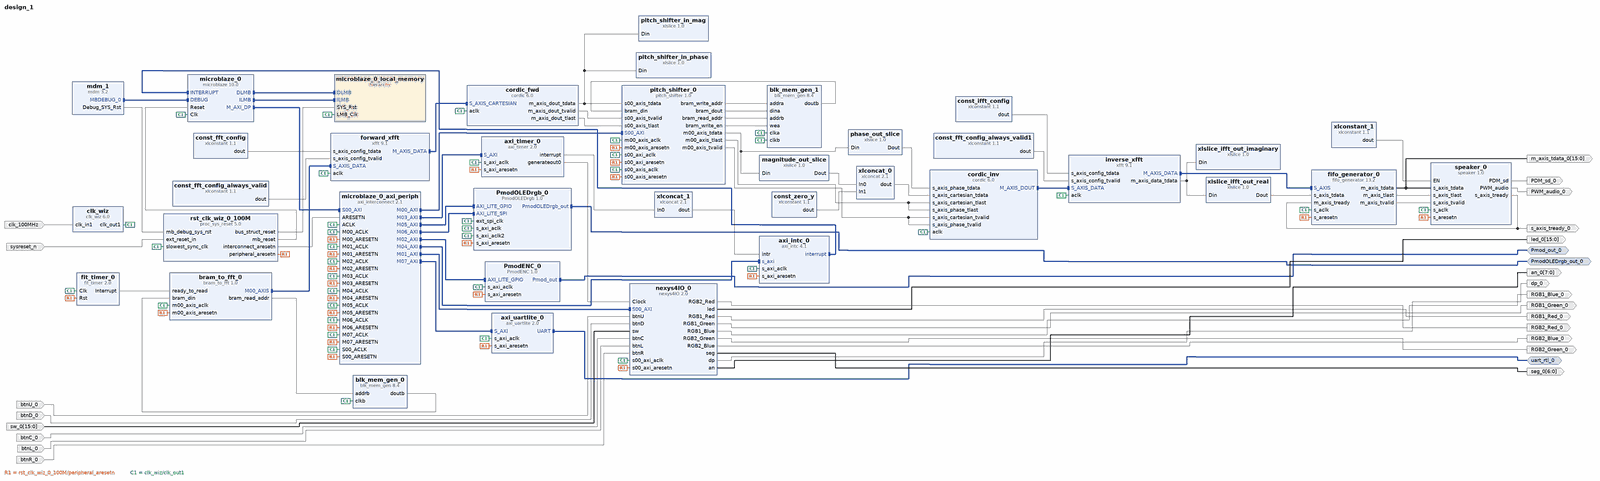
[diagram p0: block diagram of the top level, whole]
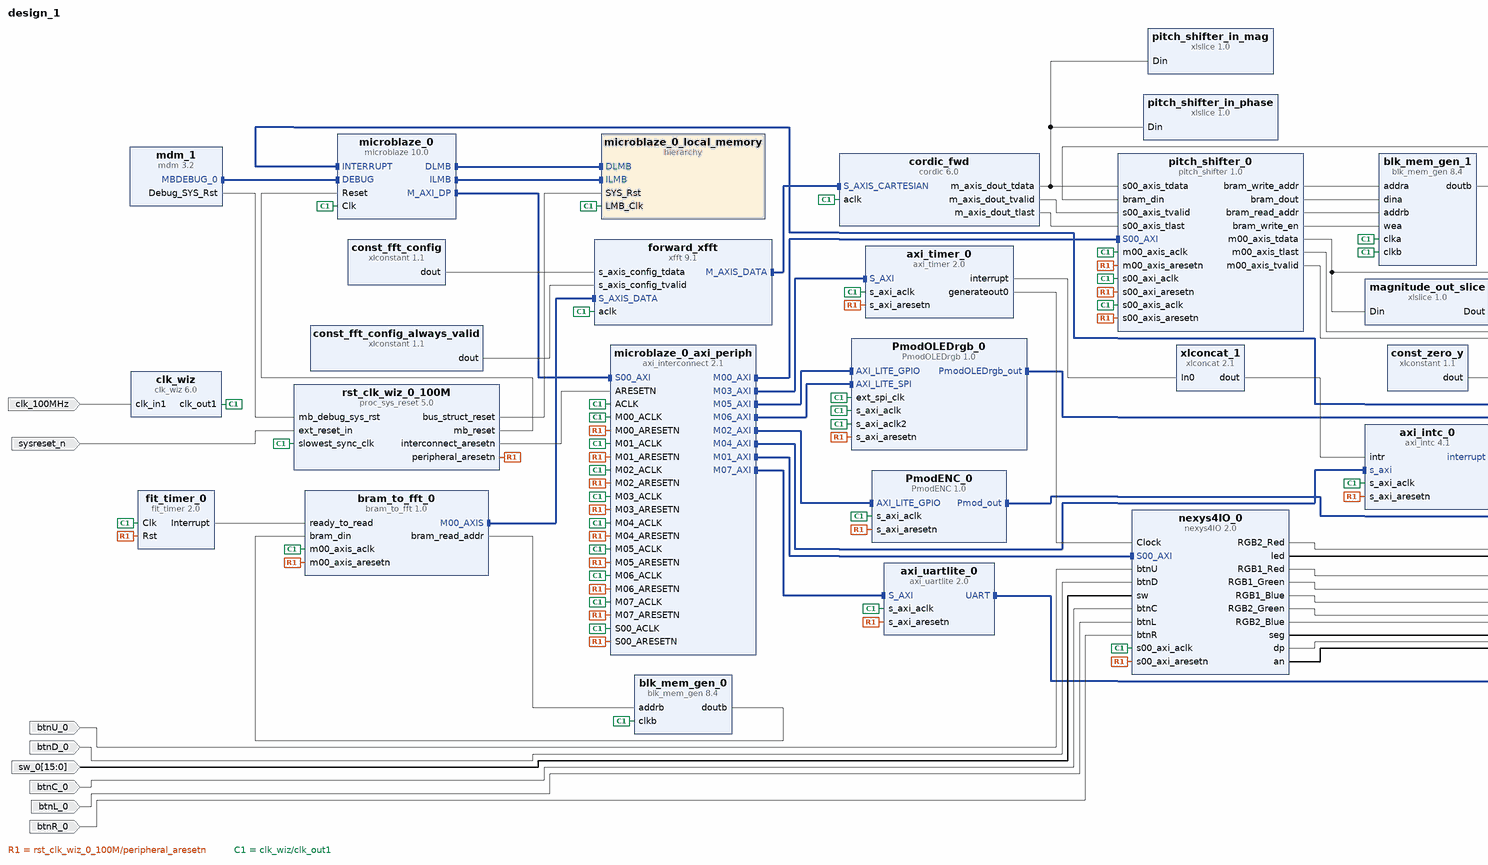
[diagram p1: block diagram of the top level, left part]
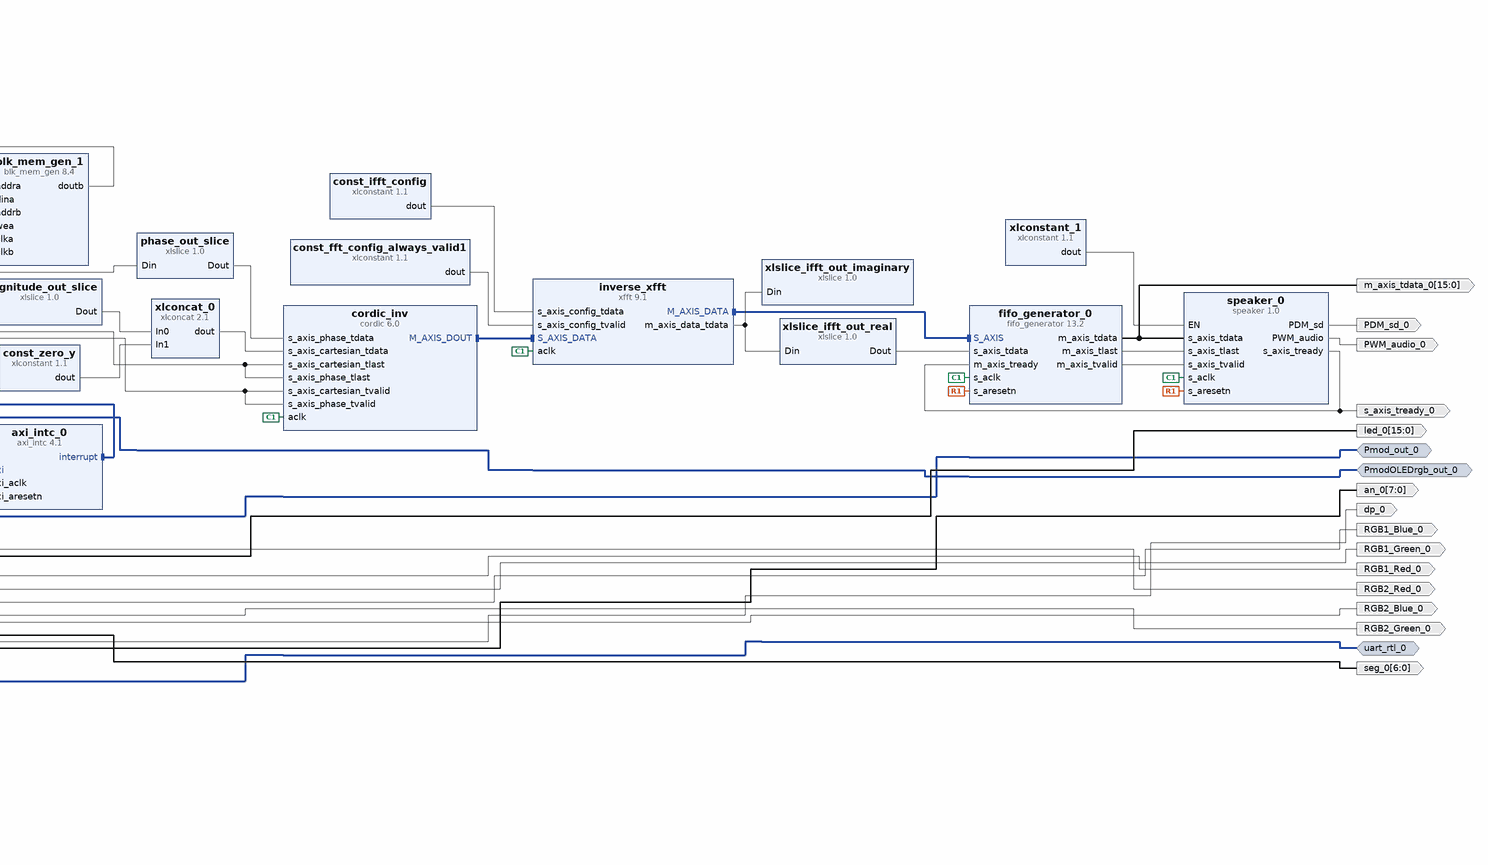
[diagram p2: block diagram of the top level, right part]
# Vivado block design design_1, xc7a100tcsg324-1, Vivado 2018.2
create_bd_design design_1

create_bd_intf_port -mode Master -vlnv digilentinc.com:interface:pmod_rtl:1.0 Pmod_out_0
create_bd_intf_port -mode Master -vlnv digilentinc.com:interface:pmod_rtl:1.0 PmodOLEDrgb_out_0
create_bd_intf_port -mode Master -vlnv xilinx.com:interface:uart_rtl:1.0 uart_rtl_0
create_bd_port -dir I -type clk clk_100MHz
set_property -dict {CONFIG.FREQ_HZ 100000000} [get_bd_ports clk_100MHz]
create_bd_port -dir I btnU_0
create_bd_port -dir I btnD_0
create_bd_port -dir I -from 15 -to 0 sw_0
create_bd_port -dir I btnC_0
create_bd_port -dir I btnL_0
create_bd_port -dir I btnR_0
create_bd_port -dir O RGB2_Red_0
create_bd_port -dir O -from 15 -to 0 led_0
create_bd_port -dir O RGB1_Red_0
create_bd_port -dir O RGB1_Green_0
create_bd_port -dir O RGB1_Blue_0
create_bd_port -dir O RGB2_Green_0
create_bd_port -dir O RGB2_Blue_0
create_bd_port -dir O -from 6 -to 0 seg_0
create_bd_port -dir O dp_0
create_bd_port -dir O -from 7 -to 0 an_0
create_bd_port -dir O PWM_audio_0
create_bd_port -dir O PDM_sd_0
create_bd_port -dir I -type rst sysreset_n
set_property -dict {CONFIG.POLARITY ACTIVE_LOW} [get_bd_ports sysreset_n]
create_bd_port -dir O -from 15 -to 0 m_axis_tdata_0
create_bd_port -dir O s_axis_tready_0

create_bd_cell -type ip -vlnv xilinx.com:ip:xfft:9.1 forward_xfft
set_property -dict [list \
  CONFIG.transform_length 4096 \
  CONFIG.target_clock_frequency 100 \
  CONFIG.implementation_options automatically_select \
  CONFIG.target_data_throughput 1 \
  CONFIG.phase_factor_width 9 \
  CONFIG.scaling_options scaled \
  CONFIG.xk_index true \
  CONFIG.output_ordering natural_order \
  CONFIG.number_of_stages_using_block_ram_for_data_and_phase_factors 0 \
] [get_bd_cells forward_xfft]
create_bd_cell -type ip -vlnv xilinx.com:ip:blk_mem_gen:8.4 blk_mem_gen_0
set_property -dict [list \
  CONFIG.Memory_Type Simple_Dual_Port_RAM \
  CONFIG.Enable_32bit_Address false \
  CONFIG.Use_Byte_Write_Enable false \
  CONFIG.Assume_Synchronous_Clk false \
  CONFIG.Write_Width_A 16 \
  CONFIG.Write_Depth_A 4096 \
  CONFIG.Operating_Mode_A READ_FIRST \
  CONFIG.Enable_A Always_Enabled \
  CONFIG.Write_Width_B 16 \
  CONFIG.Read_Width_B 16 \
  CONFIG.Enable_B Always_Enabled \
  CONFIG.Register_PortB_Output_of_Memory_Primitives true \
  CONFIG.Load_Init_File true \
  CONFIG.Coe_File ../../../sine_1khz.coe \
  CONFIG.Use_RSTB_Pin false \
  CONFIG.Port_A_Write_Rate 50 \
  CONFIG.Port_B_Clock 100 \
  CONFIG.Port_B_Enable_Rate 100 \
  CONFIG.use_bram_block Stand_Alone \
] [get_bd_cells blk_mem_gen_0]
create_bd_cell -type ip -vlnv xilinx.com:ip:proc_sys_reset:5.0 rst_clk_wiz_0_100M
create_bd_cell -type ip -vlnv xilinx.com:ip:xfft:9.1 inverse_xfft
set_property -dict [list \
  CONFIG.transform_length 4096 \
  CONFIG.target_clock_frequency 100 \
  CONFIG.implementation_options automatically_select \
  CONFIG.target_data_throughput 1 \
  CONFIG.input_width 16 \
  CONFIG.phase_factor_width 9 \
  CONFIG.scaling_options scaled \
  CONFIG.output_ordering natural_order \
  CONFIG.number_of_stages_using_block_ram_for_data_and_phase_factors 0 \
] [get_bd_cells inverse_xfft]
create_bd_cell -type ip -vlnv xilinx.com:ip:xlconstant:1.1 const_fft_config_always_valid
create_bd_cell -type ip -vlnv xilinx.com:ip:xlconstant:1.1 const_fft_config
set_property -dict {CONFIG.CONST_WIDTH 32 CONFIG.CONST_VAL 11184811} [get_bd_cells const_fft_config]
create_bd_cell -type ip -vlnv xilinx.com:ip:xlconstant:1.1 const_ifft_config
set_property -dict {CONFIG.CONST_WIDTH 32 CONFIG.CONST_VAL 0} [get_bd_cells const_ifft_config]
create_bd_cell -type ip -vlnv xilinx.com:ip:cordic:6.0 cordic_fwd
set_property -dict [list \
  CONFIG.Functional_Selection Translate \
  CONFIG.Data_Format SignedFraction \
  CONFIG.Input_Width 16 \
  CONFIG.Output_Width 16 \
  CONFIG.Coarse_Rotation true \
  CONFIG.Compensation_Scaling No_Scale_Compensation \
  CONFIG.cartesian_has_tlast true \
  CONFIG.flow_control NonBlocking \
  CONFIG.out_tlast_behv Pass_Cartesian_TLAST \
] [get_bd_cells cordic_fwd]
create_bd_cell -type ip -vlnv xilinx.com:ip:blk_mem_gen:8.4 blk_mem_gen_1
set_property -dict [list \
  CONFIG.Memory_Type Simple_Dual_Port_RAM \
  CONFIG.Enable_32bit_Address false \
  CONFIG.Use_Byte_Write_Enable false \
  CONFIG.Assume_Synchronous_Clk false \
  CONFIG.Write_Width_A 32 \
  CONFIG.Write_Depth_A 4096 \
  CONFIG.Operating_Mode_A READ_FIRST \
  CONFIG.Enable_A Always_Enabled \
  CONFIG.Write_Width_B 32 \
  CONFIG.Read_Width_B 32 \
  CONFIG.Enable_B Always_Enabled \
  CONFIG.Register_PortB_Output_of_Memory_Primitives true \
  CONFIG.Fill_Remaining_Memory_Locations true \
  CONFIG.Use_RSTB_Pin false \
  CONFIG.Port_A_Write_Rate 50 \
  CONFIG.Port_B_Clock 100 \
  CONFIG.Port_B_Enable_Rate 100 \
  CONFIG.use_bram_block Stand_Alone \
] [get_bd_cells blk_mem_gen_1]
create_bd_cell -type ip -vlnv xilinx.com:ip:clk_wiz:6.0 clk_wiz
set_property -dict {CONFIG.USE_RESET false CONFIG.RESET_PORT resetn CONFIG.RESET_TYPE ACTIVE_HIGH} [get_bd_cells clk_wiz]
create_bd_cell -type ip -vlnv xilinx.com:ip:cordic:6.0 cordic_inv
set_property -dict [list \
  CONFIG.Functional_Selection Rotate \
  CONFIG.Data_Format SignedFraction \
  CONFIG.Input_Width 16 \
  CONFIG.Output_Width 16 \
  CONFIG.Coarse_Rotation true \
  CONFIG.Compensation_Scaling No_Scale_Compensation \
  CONFIG.cartesian_has_tlast true \
  CONFIG.phase_has_tlast true \
  CONFIG.flow_control NonBlocking \
  CONFIG.out_tlast_behv Pass_Cartesian_TLAST \
] [get_bd_cells cordic_inv]
create_bd_cell -type ip -vlnv xilinx.com:ip:xlslice:1.0 magnitude_out_slice
set_property -dict [list \
  CONFIG.DIN_TO 0 \
  CONFIG.DIN_FROM 15 \
  CONFIG.DIN_WIDTH 32 \
  CONFIG.DOUT_WIDTH 16 \
] [get_bd_cells magnitude_out_slice]
create_bd_cell -type ip -vlnv xilinx.com:ip:xlslice:1.0 phase_out_slice
set_property -dict {CONFIG.DIN_TO 16 CONFIG.DIN_FROM 31 CONFIG.DIN_WIDTH 32 CONFIG.DOUT_WIDTH 16} [get_bd_cells phase_out_slice]
create_bd_cell -type ip -vlnv xilinx.com:ip:xlconcat:2.1 xlconcat_0
create_bd_cell -type ip -vlnv xilinx.com:ip:xlconstant:1.1 const_zero_y
set_property -dict {CONFIG.CONST_WIDTH 16 CONFIG.CONST_VAL 0} [get_bd_cells const_zero_y]
create_bd_cell -type ip -vlnv xilinx.com:ip:xlconstant:1.1 const_fft_config_always_valid1
create_bd_cell -type ip -vlnv xilinx.com:ip:xlslice:1.0 xlslice_ifft_out_real
set_property -dict {CONFIG.DIN_FROM 15 CONFIG.DOUT_WIDTH 16} [get_bd_cells xlslice_ifft_out_real]
create_bd_cell -type ip -vlnv xilinx.com:ip:xlslice:1.0 xlslice_ifft_out_imaginary
set_property -dict {CONFIG.DIN_FROM 15 CONFIG.DOUT_WIDTH 16} [get_bd_cells xlslice_ifft_out_imaginary]
create_bd_cell -type ip -vlnv xilinx.com:ip:xlslice:1.0 pitch_shifter_in_mag
set_property -dict {CONFIG.DIN_FROM 15 CONFIG.DOUT_WIDTH 16} [get_bd_cells pitch_shifter_in_mag]
create_bd_cell -type ip -vlnv xilinx.com:ip:xlslice:1.0 pitch_shifter_in_phase
set_property -dict {CONFIG.DIN_TO 16 CONFIG.DIN_FROM 31 CONFIG.DOUT_WIDTH 16} [get_bd_cells pitch_shifter_in_phase]
create_bd_cell -type ip -vlnv user.org:user:bram_to_fft:1.0 bram_to_fft_0
create_bd_cell -type ip -vlnv xilinx.com:ip:microblaze:10.0 microblaze_0
set_property -dict {CONFIG.C_D_AXI 1 CONFIG.C_D_LMB 1 CONFIG.C_I_LMB 1 CONFIG.C_DEBUG_ENABLED 1} [get_bd_cells microblaze_0]
create_bd_cell -type hier microblaze_0_local_memory
create_bd_cell -type ip -vlnv xilinx.com:ip:mdm:3.2 mdm_1
create_bd_cell -type ip -vlnv xilinx.com:ip:axi_interconnect:2.1 microblaze_0_axi_periph
set_property -dict {CONFIG.NUM_MI 8} [get_bd_cells microblaze_0_axi_periph]
create_bd_cell -type ip -vlnv xilinx.com:user:nexys4IO:2.0 nexys4IO_0
create_bd_cell -type ip -vlnv digilentinc.com:IP:PmodENC:1.0 PmodENC_0
create_bd_cell -type ip -vlnv xilinx.com:ip:axi_timer:2.0 axi_timer_0
create_bd_cell -type ip -vlnv xilinx.com:ip:axi_intc:4.1 axi_intc_0
create_bd_cell -type ip -vlnv digilentinc.com:IP:PmodOLEDrgb:1.0 PmodOLEDrgb_0
create_bd_cell -type ip -vlnv xilinx.com:ip:xlconcat:2.1 xlconcat_1
set_property -dict {CONFIG.NUM_PORTS 1} [get_bd_cells xlconcat_1]
create_bd_cell -type ip -vlnv xilinx.com:ip:xlconstant:1.1 xlconstant_1
set_property -dict {CONFIG.CONST_VAL 0} [get_bd_cells xlconstant_1]
create_bd_cell -type ip -vlnv xilinx.com:ip:fifo_generator:13.2 fifo_generator_0
set_property -dict [list \
  CONFIG.INTERFACE_TYPE AXI_STREAM \
  CONFIG.Full_Flags_Reset_Value 1 \
  CONFIG.TDATA_NUM_BYTES 2 \
  CONFIG.TUSER_WIDTH 0 \
  CONFIG.Enable_TLAST true \
  CONFIG.FIFO_Implementation_wach Common_Clock_Distributed_RAM \
  CONFIG.FIFO_Implementation_wrch Common_Clock_Distributed_RAM \
  CONFIG.FIFO_Implementation_rach Common_Clock_Distributed_RAM \
  CONFIG.FIFO_Application_Type_axis Data_FIFO \
  CONFIG.Input_Depth_axis 4096 \
  CONFIG.Enable_Safety_Circuit true \
] [get_bd_cells fifo_generator_0]
create_bd_cell -type ip -vlnv xilinx.com:ip:fit_timer:2.0 fit_timer_0
set_property -dict {CONFIG.C_NO_CLOCKS 9200000} [get_bd_cells fit_timer_0]
create_bd_cell -type ip -vlnv xilinx.com:ip:axi_uartlite:2.0 axi_uartlite_0
create_bd_cell -type ip -vlnv user.org:user:pitch_shifter:1.0 pitch_shifter_0
set_property -dict {CONFIG.C_M00_AXIS_TDATA_WIDTH 32 CONFIG.C_S00_AXIS_TDATA_WIDTH 32} [get_bd_cells pitch_shifter_0]
create_bd_cell -type ip -vlnv user.org:user:speaker:1.0 speaker_0
set_property -dict {CONFIG.AUD_SAMPLE_FREQ_HZ 32768} [get_bd_cells speaker_0]

# ---- hierarchy /microblaze_0_local_memory ----
current_bd_instance /microblaze_0_local_memory
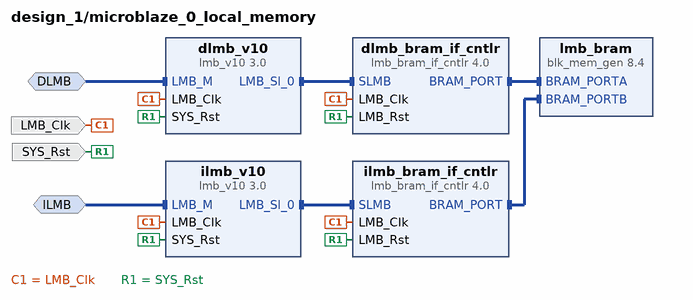
[diagram p3: block diagram inside /microblaze_0_local_memory]
create_bd_intf_pin -mode MirroredMaster -vlnv xilinx.com:interface:lmb_rtl:1.0 DLMB
create_bd_intf_pin -mode MirroredMaster -vlnv xilinx.com:interface:lmb_rtl:1.0 ILMB
create_bd_pin -dir I -type clk LMB_Clk
create_bd_pin -dir I -type rst SYS_Rst

create_bd_cell -type ip -vlnv xilinx.com:ip:lmb_v10:3.0 dlmb_v10
create_bd_cell -type ip -vlnv xilinx.com:ip:lmb_v10:3.0 ilmb_v10
create_bd_cell -type ip -vlnv xilinx.com:ip:lmb_bram_if_cntlr:4.0 dlmb_bram_if_cntlr
set_property -dict {CONFIG.C_ECC 0} [get_bd_cells dlmb_bram_if_cntlr]
create_bd_cell -type ip -vlnv xilinx.com:ip:lmb_bram_if_cntlr:4.0 ilmb_bram_if_cntlr
set_property -dict {CONFIG.C_ECC 0} [get_bd_cells ilmb_bram_if_cntlr]
create_bd_cell -type ip -vlnv xilinx.com:ip:blk_mem_gen:8.4 lmb_bram
set_property -dict {CONFIG.Memory_Type True_Dual_Port_RAM CONFIG.use_bram_block BRAM_Controller} [get_bd_cells lmb_bram]

# ---- connections ----

current_bd_instance /microblaze_0_local_memory
connect_bd_intf_net -intf_net microblaze_0_dlmb_bus [get_bd_intf_pins dlmb_v10/LMB_Sl_0] [get_bd_intf_pins dlmb_bram_if_cntlr/SLMB]
connect_bd_intf_net -intf_net microblaze_0_ilmb_bus [get_bd_intf_pins ilmb_v10/LMB_Sl_0] [get_bd_intf_pins ilmb_bram_if_cntlr/SLMB]
connect_bd_intf_net -intf_net microblaze_0_dlmb_cntlr [get_bd_intf_pins dlmb_bram_if_cntlr/BRAM_PORT] [get_bd_intf_pins lmb_bram/BRAM_PORTA]
connect_bd_intf_net -intf_net microblaze_0_ilmb_cntlr [get_bd_intf_pins ilmb_bram_if_cntlr/BRAM_PORT] [get_bd_intf_pins lmb_bram/BRAM_PORTB]
connect_bd_intf_net -intf_net microblaze_0_dlmb [get_bd_intf_pins DLMB] [get_bd_intf_pins dlmb_v10/LMB_M]
connect_bd_intf_net -intf_net microblaze_0_ilmb [get_bd_intf_pins ILMB] [get_bd_intf_pins ilmb_v10/LMB_M]
connect_bd_net -net microblaze_0_Clk [get_bd_pins LMB_Clk] \
  [get_bd_pins dlmb_v10/LMB_Clk] [get_bd_pins dlmb_bram_if_cntlr/LMB_Clk] [get_bd_pins ilmb_v10/LMB_Clk] \
  [get_bd_pins ilmb_bram_if_cntlr/LMB_Clk]
connect_bd_net [get_bd_pins SYS_Rst] \
  [get_bd_pins dlmb_v10/SYS_Rst] [get_bd_pins dlmb_bram_if_cntlr/LMB_Rst] [get_bd_pins ilmb_v10/SYS_Rst] \
  [get_bd_pins ilmb_bram_if_cntlr/LMB_Rst]

current_bd_instance /
connect_bd_intf_net [get_bd_intf_pins bram_to_fft_0/M00_AXIS] [get_bd_intf_pins forward_xfft/S_AXIS_DATA]
connect_bd_intf_net [get_bd_intf_pins forward_xfft/M_AXIS_DATA] [get_bd_intf_pins cordic_fwd/S_AXIS_CARTESIAN]
connect_bd_intf_net [get_bd_intf_pins cordic_inv/M_AXIS_DOUT] [get_bd_intf_pins inverse_xfft/S_AXIS_DATA]
connect_bd_intf_net [get_bd_intf_pins microblaze_0/DLMB] [get_bd_intf_pins microblaze_0_local_memory/DLMB]
connect_bd_intf_net [get_bd_intf_pins microblaze_0/ILMB] [get_bd_intf_pins microblaze_0_local_memory/ILMB]
connect_bd_intf_net [get_bd_intf_pins mdm_1/MBDEBUG_0] [get_bd_intf_pins microblaze_0/DEBUG]
connect_bd_intf_net [get_bd_intf_pins microblaze_0/M_AXI_DP] [get_bd_intf_pins microblaze_0_axi_periph/S00_AXI]
connect_bd_intf_net [get_bd_intf_pins microblaze_0_axi_periph/M00_AXI] [get_bd_intf_pins pitch_shifter_0/S00_AXI]
connect_bd_intf_net [get_bd_intf_pins microblaze_0_axi_periph/M01_AXI] [get_bd_intf_pins nexys4IO_0/S00_AXI]
connect_bd_intf_net [get_bd_intf_pins microblaze_0_axi_periph/M02_AXI] [get_bd_intf_pins PmodENC_0/AXI_LITE_GPIO]
connect_bd_intf_net [get_bd_intf_pins microblaze_0_axi_periph/M03_AXI] [get_bd_intf_pins axi_timer_0/S_AXI]
connect_bd_intf_net [get_bd_intf_pins microblaze_0_axi_periph/M04_AXI] [get_bd_intf_pins axi_intc_0/s_axi]
connect_bd_intf_net [get_bd_intf_pins axi_intc_0/interrupt] [get_bd_intf_pins microblaze_0/INTERRUPT]
connect_bd_intf_net [get_bd_intf_pins microblaze_0_axi_periph/M05_AXI] [get_bd_intf_pins PmodOLEDrgb_0/AXI_LITE_GPIO]
connect_bd_intf_net [get_bd_intf_pins microblaze_0_axi_periph/M06_AXI] [get_bd_intf_pins PmodOLEDrgb_0/AXI_LITE_SPI]
connect_bd_intf_net [get_bd_intf_pins inverse_xfft/M_AXIS_DATA] [get_bd_intf_pins fifo_generator_0/S_AXIS]
connect_bd_intf_net [get_bd_intf_pins microblaze_0_axi_periph/M07_AXI] [get_bd_intf_pins axi_uartlite_0/S_AXI]
connect_bd_intf_net [get_bd_intf_ports Pmod_out_0] [get_bd_intf_pins PmodENC_0/Pmod_out]
connect_bd_intf_net [get_bd_intf_ports PmodOLEDrgb_out_0] [get_bd_intf_pins PmodOLEDrgb_0/PmodOLEDrgb_out]
connect_bd_intf_net [get_bd_intf_ports uart_rtl_0] [get_bd_intf_pins axi_uartlite_0/UART]
connect_bd_net [get_bd_pins rst_clk_wiz_0_100M/peripheral_aresetn] \
  [get_bd_pins bram_to_fft_0/m00_axis_aresetn] [get_bd_pins nexys4IO_0/s00_axi_aresetn] [get_bd_pins PmodENC_0/s_axi_aresetn] \
  [get_bd_pins axi_timer_0/s_axi_aresetn] [get_bd_pins axi_intc_0/s_axi_aresetn] [get_bd_pins PmodOLEDrgb_0/s_axi_aresetn] \
  [get_bd_pins fifo_generator_0/s_aresetn] [get_bd_pins fit_timer_0/Rst] [get_bd_pins axi_uartlite_0/s_axi_aresetn] \
  [get_bd_pins pitch_shifter_0/m00_axis_aresetn] [get_bd_pins pitch_shifter_0/s00_axis_aresetn] \
  [get_bd_pins pitch_shifter_0/s00_axi_aresetn] [get_bd_pins microblaze_0_axi_periph/S00_ARESETN] \
  [get_bd_pins microblaze_0_axi_periph/M00_ARESETN] [get_bd_pins microblaze_0_axi_periph/M01_ARESETN] \
  [get_bd_pins microblaze_0_axi_periph/M02_ARESETN] [get_bd_pins microblaze_0_axi_periph/M03_ARESETN] \
  [get_bd_pins microblaze_0_axi_periph/M04_ARESETN] [get_bd_pins microblaze_0_axi_periph/M05_ARESETN] \
  [get_bd_pins microblaze_0_axi_periph/M06_ARESETN] [get_bd_pins microblaze_0_axi_periph/M07_ARESETN] \
  [get_bd_pins speaker_0/s_aresetn]
connect_bd_net [get_bd_pins bram_to_fft_0/bram_read_addr] [get_bd_pins blk_mem_gen_0/addrb]
connect_bd_net [get_bd_pins blk_mem_gen_0/doutb] [get_bd_pins bram_to_fft_0/bram_din]
connect_bd_net -net xlconstant_1_dout [get_bd_pins const_fft_config/dout] [get_bd_pins forward_xfft/s_axis_config_tdata]
connect_bd_net -net xlconstant_2_dout [get_bd_pins const_ifft_config/dout] [get_bd_pins inverse_xfft/s_axis_config_tdata]
connect_bd_net [get_bd_pins pitch_shifter_0/bram_write_addr] [get_bd_pins blk_mem_gen_1/addra]
connect_bd_net [get_bd_pins pitch_shifter_0/bram_dout] [get_bd_pins blk_mem_gen_1/dina]
connect_bd_net [get_bd_pins pitch_shifter_0/bram_read_addr] [get_bd_pins blk_mem_gen_1/addrb]
connect_bd_net [get_bd_pins pitch_shifter_0/bram_write_en] [get_bd_pins blk_mem_gen_1/wea]
connect_bd_net [get_bd_pins blk_mem_gen_1/doutb] [get_bd_pins pitch_shifter_0/bram_din]
connect_bd_net -net microblaze_0_Clk [get_bd_pins clk_wiz/clk_out1] \
  [get_bd_pins forward_xfft/aclk] [get_bd_pins cordic_fwd/aclk] [get_bd_pins inverse_xfft/aclk] \
  [get_bd_pins blk_mem_gen_0/clkb] [get_bd_pins blk_mem_gen_1/clkb] [get_bd_pins blk_mem_gen_1/clka] \
  [get_bd_pins rst_clk_wiz_0_100M/slowest_sync_clk] [get_bd_pins cordic_inv/aclk] [get_bd_pins bram_to_fft_0/m00_axis_aclk] \
  [get_bd_pins microblaze_0/Clk] [get_bd_pins nexys4IO_0/s00_axi_aclk] [get_bd_pins PmodENC_0/s_axi_aclk] \
  [get_bd_pins axi_timer_0/s_axi_aclk] [get_bd_pins axi_intc_0/s_axi_aclk] [get_bd_pins PmodOLEDrgb_0/s_axi_aclk] \
  [get_bd_pins PmodOLEDrgb_0/s_axi_aclk2] [get_bd_pins PmodOLEDrgb_0/ext_spi_clk] [get_bd_pins fifo_generator_0/s_aclk] \
  [get_bd_pins fit_timer_0/Clk] [get_bd_pins axi_uartlite_0/s_axi_aclk] [get_bd_pins pitch_shifter_0/m00_axis_aclk] \
  [get_bd_pins pitch_shifter_0/s00_axis_aclk] [get_bd_pins pitch_shifter_0/s00_axi_aclk] \
  [get_bd_pins microblaze_0_local_memory/LMB_Clk] [get_bd_pins microblaze_0_axi_periph/ACLK] \
  [get_bd_pins microblaze_0_axi_periph/S00_ACLK] [get_bd_pins microblaze_0_axi_periph/M00_ACLK] \
  [get_bd_pins microblaze_0_axi_periph/M01_ACLK] [get_bd_pins microblaze_0_axi_periph/M02_ACLK] \
  [get_bd_pins microblaze_0_axi_periph/M03_ACLK] [get_bd_pins microblaze_0_axi_periph/M04_ACLK] \
  [get_bd_pins microblaze_0_axi_periph/M05_ACLK] [get_bd_pins microblaze_0_axi_periph/M06_ACLK] \
  [get_bd_pins microblaze_0_axi_periph/M07_ACLK] [get_bd_pins speaker_0/s_aclk]
connect_bd_net [get_bd_ports clk_100MHz] [get_bd_pins clk_wiz/clk_in1]
connect_bd_net [get_bd_pins phase_out_slice/Dout] [get_bd_pins cordic_inv/s_axis_phase_tdata]
connect_bd_net [get_bd_pins magnitude_out_slice/Dout] [get_bd_pins xlconcat_0/In0]
connect_bd_net -net xlconstant_0_dout1 [get_bd_pins const_zero_y/dout] [get_bd_pins xlconcat_0/In1]
connect_bd_net [get_bd_pins xlconcat_0/dout] [get_bd_pins cordic_inv/s_axis_cartesian_tdata]
connect_bd_net [get_bd_pins const_fft_config_always_valid/dout] [get_bd_pins forward_xfft/s_axis_config_tvalid]
connect_bd_net [get_bd_pins const_fft_config_always_valid1/dout] [get_bd_pins inverse_xfft/s_axis_config_tvalid]
connect_bd_net [get_bd_pins inverse_xfft/m_axis_data_tdata] [get_bd_pins xlslice_ifft_out_real/Din] [get_bd_pins xlslice_ifft_out_imaginary/Din]
connect_bd_net [get_bd_pins cordic_fwd/m_axis_dout_tdata] \
  [get_bd_pins pitch_shifter_in_mag/Din] [get_bd_pins pitch_shifter_in_phase/Din] \
  [get_bd_pins pitch_shifter_0/s00_axis_tdata]
connect_bd_net [get_bd_pins cordic_fwd/m_axis_dout_tvalid] [get_bd_pins pitch_shifter_0/s00_axis_tvalid]
connect_bd_net [get_bd_pins cordic_fwd/m_axis_dout_tlast] [get_bd_pins pitch_shifter_0/s00_axis_tlast]
connect_bd_net [get_bd_pins pitch_shifter_0/m00_axis_tdata] [get_bd_pins phase_out_slice/Din] [get_bd_pins magnitude_out_slice/Din]
connect_bd_net [get_bd_pins pitch_shifter_0/m00_axis_tlast] \
  [get_bd_pins cordic_inv/s_axis_phase_tlast] [get_bd_pins cordic_inv/s_axis_cartesian_tlast]
connect_bd_net [get_bd_pins pitch_shifter_0/m00_axis_tvalid] \
  [get_bd_pins cordic_inv/s_axis_cartesian_tvalid] [get_bd_pins cordic_inv/s_axis_phase_tvalid]
connect_bd_net [get_bd_pins rst_clk_wiz_0_100M/mb_reset] [get_bd_pins microblaze_0/Reset]
connect_bd_net [get_bd_pins rst_clk_wiz_0_100M/bus_struct_reset] [get_bd_pins microblaze_0_local_memory/SYS_Rst]
connect_bd_net [get_bd_pins mdm_1/Debug_SYS_Rst] [get_bd_pins rst_clk_wiz_0_100M/mb_debug_sys_rst]
connect_bd_net [get_bd_pins rst_clk_wiz_0_100M/interconnect_aresetn] [get_bd_pins microblaze_0_axi_periph/ARESETN]
connect_bd_net -net btnU_0_1 [get_bd_ports btnU_0] [get_bd_pins nexys4IO_0/btnU]
connect_bd_net -net btnD_0_1 [get_bd_ports btnD_0] [get_bd_pins nexys4IO_0/btnD]
connect_bd_net -net sw_0_1 [get_bd_ports sw_0] [get_bd_pins nexys4IO_0/sw]
connect_bd_net -net btnC_0_1 [get_bd_ports btnC_0] [get_bd_pins nexys4IO_0/btnC]
connect_bd_net -net btnL_0_1 [get_bd_ports btnL_0] [get_bd_pins nexys4IO_0/btnL]
connect_bd_net -net btnR_0_1 [get_bd_ports btnR_0] [get_bd_pins nexys4IO_0/btnR]
connect_bd_net [get_bd_pins nexys4IO_0/RGB2_Red] [get_bd_ports RGB2_Red_0]
connect_bd_net [get_bd_pins nexys4IO_0/led] [get_bd_ports led_0]
connect_bd_net [get_bd_pins nexys4IO_0/RGB1_Red] [get_bd_ports RGB1_Red_0]
connect_bd_net [get_bd_pins nexys4IO_0/RGB1_Green] [get_bd_ports RGB1_Green_0]
connect_bd_net [get_bd_pins nexys4IO_0/RGB1_Blue] [get_bd_ports RGB1_Blue_0]
connect_bd_net [get_bd_pins nexys4IO_0/RGB2_Green] [get_bd_ports RGB2_Green_0]
connect_bd_net [get_bd_pins nexys4IO_0/RGB2_Blue] [get_bd_ports RGB2_Blue_0]
connect_bd_net [get_bd_pins nexys4IO_0/seg] [get_bd_ports seg_0]
connect_bd_net [get_bd_pins nexys4IO_0/dp] [get_bd_ports dp_0]
connect_bd_net [get_bd_pins nexys4IO_0/an] [get_bd_ports an_0]
connect_bd_net [get_bd_pins axi_timer_0/interrupt] [get_bd_pins xlconcat_1/In0]
connect_bd_net [get_bd_pins xlconcat_1/dout] [get_bd_pins axi_intc_0/intr]
connect_bd_net [get_bd_pins axi_timer_0/generateout0] [get_bd_pins nexys4IO_0/Clock]
connect_bd_net [get_bd_pins xlconstant_1/dout] [get_bd_pins speaker_0/EN]
connect_bd_net [get_bd_pins speaker_0/PWM_audio] [get_bd_ports PWM_audio_0]
connect_bd_net [get_bd_pins speaker_0/PDM_sd] [get_bd_ports PDM_sd_0]
connect_bd_net [get_bd_pins xlslice_ifft_out_real/Dout] [get_bd_pins fifo_generator_0/s_axis_tdata]
connect_bd_net [get_bd_ports sysreset_n] [get_bd_pins rst_clk_wiz_0_100M/ext_reset_in]
connect_bd_net [get_bd_pins fifo_generator_0/m_axis_tdata] [get_bd_ports m_axis_tdata_0] [get_bd_pins speaker_0/s_axis_tdata]
connect_bd_net [get_bd_pins speaker_0/s_axis_tready] [get_bd_ports s_axis_tready_0] [get_bd_pins fifo_generator_0/m_axis_tready]
connect_bd_net [get_bd_pins fit_timer_0/Interrupt] [get_bd_pins bram_to_fft_0/ready_to_read]
connect_bd_net [get_bd_pins fifo_generator_0/m_axis_tlast] [get_bd_pins speaker_0/s_axis_tlast]
connect_bd_net [get_bd_pins fifo_generator_0/m_axis_tvalid] [get_bd_pins speaker_0/s_axis_tvalid]

# ---- address map ----
assign_bd_address -offset 0x00000000 -range 128K -target_address_space [get_bd_addr_spaces microblaze_0/Data] [get_bd_addr_segs microblaze_0_local_memory/dlmb_bram_if_cntlr/SLMB/Mem]
assign_bd_address -offset 0x40600000 -range 64K -target_address_space [get_bd_addr_spaces microblaze_0/Data] [get_bd_addr_segs axi_uartlite_0/S_AXI/Reg]
assign_bd_address -offset 0x41200000 -range 64K -target_address_space [get_bd_addr_spaces microblaze_0/Data] [get_bd_addr_segs axi_intc_0/S_AXI/Reg]
assign_bd_address -offset 0x41C00000 -range 64K -target_address_space [get_bd_addr_spaces microblaze_0/Data] [get_bd_addr_segs axi_timer_0/S_AXI/Reg]
assign_bd_address -offset 0x44A00000 -range 64K -target_address_space [get_bd_addr_spaces microblaze_0/Data] [get_bd_addr_segs pitch_shifter_0/S00_AXI/S00_AXI_reg]
assign_bd_address -offset 0x44A10000 -range 64K -target_address_space [get_bd_addr_spaces microblaze_0/Data] [get_bd_addr_segs nexys4IO_0/S00_AXI/S00_AXI_reg]
assign_bd_address -offset 0x44A20000 -range 64K -target_address_space [get_bd_addr_spaces microblaze_0/Data] [get_bd_addr_segs PmodOLEDrgb_0/AXI_LITE_GPIO/AXI_LITE_GPIO_reg]
assign_bd_address -offset 0x44A30000 -range 64K -target_address_space [get_bd_addr_spaces microblaze_0/Data] [get_bd_addr_segs PmodOLEDrgb_0/AXI_LITE_SPI/AXI_LITE_SPI_reg]
assign_bd_address -offset 0x44A40000 -range 64K -target_address_space [get_bd_addr_spaces microblaze_0/Data] [get_bd_addr_segs PmodENC_0/AXI_LITE_GPIO/Reg]
assign_bd_address -offset 0x00000000 -range 128K -target_address_space [get_bd_addr_spaces microblaze_0/Instruction] [get_bd_addr_segs microblaze_0_local_memory/ilmb_bram_if_cntlr/SLMB/Mem]

validate_bd_design
save_bd_design
